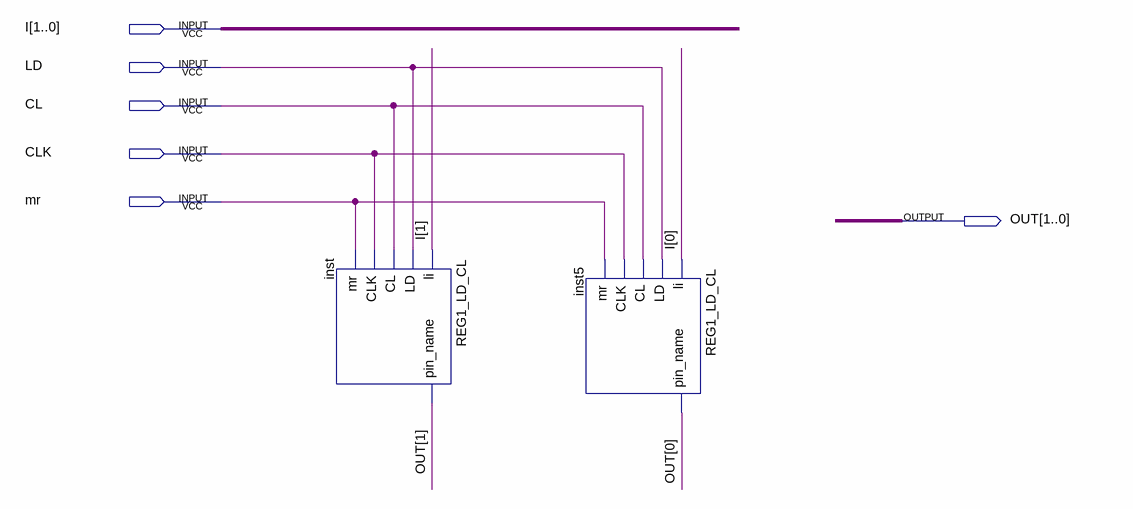
[diagram p0: schematic sheet]
// Quartus schematic REG2_LD_ST.bdf as structural Verilog: 2 symbols, 6 pins
module REG2_LD_ST (
  input  [1:0] I,
  input  LD,
  input  CL,
  input  CLK,
  input  mr,
  output [1:0] OUT
);

  REG1_LD_CL inst (.li(I[1]), .LD(LD), .CL(CL), .CLK(CLK), .mr(mr), .pin_name(OUT[1]));
  REG1_LD_CL inst5 (.li(I[0]), .LD(LD), .CL(CL), .CLK(CLK), .mr(mr), .pin_name(OUT[0]));
endmodule
